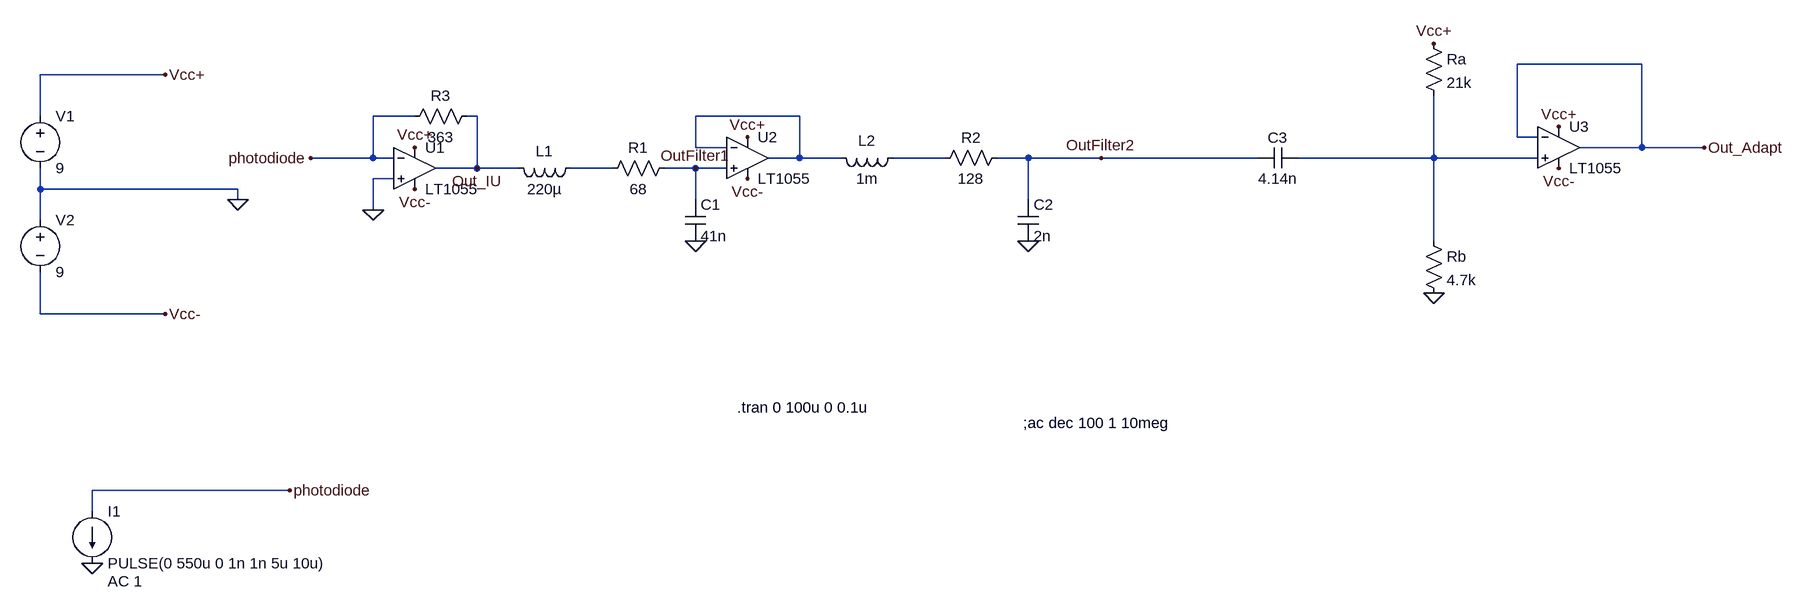
[diagram p0: schematic adaptateur_adc.asc]
adaptateur_adc.asc, the LTspice schematic file:
Version 4
SHEET 1 2272 680
WIRE 2032 -448 1840 -448
WIRE -240 -432 -432 -432
WIRE -432 -368 -432 -432
WIRE 144 -368 80 -368
WIRE 240 -368 224 -368
WIRE 736 -368 576 -368
WIRE 1840 -336 1840 -448
WIRE 1872 -336 1840 -336
WIRE 576 -320 576 -368
WIRE 624 -320 576 -320
WIRE 2032 -320 2032 -448
WIRE 2032 -320 1936 -320
WIRE 2128 -320 2032 -320
WIRE 80 -304 80 -368
WIRE 80 -304 -16 -304
WIRE 112 -304 80 -304
WIRE 736 -304 736 -368
WIRE 736 -304 688 -304
WIRE 800 -304 736 -304
WIRE 960 -304 880 -304
WIRE 1088 -304 1040 -304
WIRE 1200 -304 1088 -304
WIRE 1440 -304 1200 -304
WIRE 1712 -304 1712 -400
WIRE 1712 -304 1504 -304
WIRE 1872 -304 1712 -304
WIRE 240 -288 240 -368
WIRE 240 -288 176 -288
WIRE 304 -288 240 -288
WIRE 448 -288 384 -288
WIRE 576 -288 528 -288
WIRE 624 -288 576 -288
WIRE 112 -272 80 -272
WIRE -432 -256 -432 -288
WIRE -128 -256 -432 -256
WIRE -128 -240 -128 -256
WIRE 576 -240 576 -288
WIRE 1088 -240 1088 -304
WIRE 80 -224 80 -272
WIRE -432 -208 -432 -256
WIRE 1712 -176 1712 -304
WIRE -432 -64 -432 -128
WIRE -240 -64 -432 -64
WIRE -48 208 -352 208
WIRE -352 240 -352 208
FLAG -128 -240 0
FLAG 1088 -176 0
FLAG 576 -176 0
FLAG -240 -432 Vcc+
FLAG -240 -64 Vcc-
FLAG 144 -320 Vcc+
FLAG 656 -336 Vcc+
FLAG 144 -256 Vcc-
FLAG 656 -272 Vcc-
FLAG 576 -288 OutFilter1
FLAG 1200 -304 OutFilter2
FLAG -48 208 photodiode
FLAG -352 320 0
FLAG 80 -224 0
FLAG -16 -304 photodiode
FLAG 240 -288 Out_IU
FLAG 2128 -320 Out_Adapt
FLAG 1904 -352 Vcc+
FLAG 1904 -288 Vcc-
FLAG 1712 -96 0
FLAG 1712 -480 Vcc+
SYMBOL res 544 -304 R90
WINDOW 0 0 56 VBottom 2
WINDOW 3 32 56 VTop 2
SYMATTR InstName R1
SYMATTR Value 68
SYMBOL res 1056 -320 R90
WINDOW 0 0 56 VBottom 2
WINDOW 3 32 56 VTop 2
SYMATTR InstName R2
SYMATTR Value 128
SYMBOL ind 400 -304 R90
WINDOW 0 5 56 VBottom 2
WINDOW 3 32 56 VTop 2
SYMATTR InstName L1
SYMATTR Value 220µ
SYMATTR SpiceLine Ipk=0.6 Rser=0.75 Rpar=144700 Cpar=3.235p mfg="Bourns, Inc." pn="SDE0805A-221K"
SYMBOL ind 896 -320 R90
WINDOW 0 5 56 VBottom 2
WINDOW 3 32 56 VTop 2
SYMATTR InstName L2
SYMATTR Value 1m
SYMATTR SpiceLine Ipk=0.135 Rser=11.5 Rpar=408191 Cpar=0 mfg="Bourns, Inc." pn="SDR0503-102KL"
SYMBOL OpAmps\\LT1055 144 -352 R0
SYMATTR InstName U1
SYMBOL OpAmps\\LT1055 656 -368 R0
SYMATTR InstName U2
SYMBOL cap 560 -240 R0
SYMATTR InstName C1
SYMATTR Value 41n
SYMBOL cap 1072 -240 R0
SYMATTR InstName C2
SYMATTR Value 2n
SYMBOL voltage -432 -384 R0
WINDOW 123 0 0 Left 0
WINDOW 39 0 0 Left 0
SYMATTR InstName V1
SYMATTR Value 9
SYMBOL voltage -432 -224 R0
WINDOW 123 0 0 Left 0
WINDOW 39 0 0 Left 0
SYMATTR InstName V2
SYMATTR Value 9
SYMBOL res 240 -384 R90
WINDOW 0 0 56 VBottom 2
WINDOW 3 32 56 VTop 2
SYMATTR InstName R3
SYMATTR Value 363
SYMBOL current -352 240 R0
WINDOW 123 24 108 Left 2
WINDOW 39 0 0 Left 0
SYMATTR Value2 AC 1
SYMATTR InstName I1
SYMATTR Value PULSE(0 550u 0 1n 1n 5u 10u)
SYMBOL cap 1504 -320 R90
WINDOW 0 0 32 VBottom 2
WINDOW 3 32 32 VTop 2
SYMATTR InstName C3
SYMATTR Value 4.14n
SYMBOL res 1696 -496 R0
SYMATTR InstName Ra
SYMATTR Value 21k
SYMBOL res 1696 -192 R0
SYMATTR InstName Rb
SYMATTR Value 4.7k
SYMBOL OpAmps\\LT1055 1904 -384 R0
SYMATTR InstName U3
TEXT 640 80 Left 2 !.tran 0 100u 0 0.1u
TEXT 1080 104 Left 2 !;ac dec 100 1 10meg

The netlist it stands for:
* adaptateur_adc.asc
R1 OutFilter1 N004 68
R2 OutFilter2 N002 128
L1 N004 Out_IU 220µ Ipk=0.6 Rser=0.75 Rpar=144700 Cpar=3.235p mfg="Bourns, Inc." pn="SDE0805A-221K"
L2 N002 N001 1m Ipk=0.135 Rser=11.5 Rpar=408191 Cpar=0 mfg="Bourns, Inc." pn="SDR0503-102KL"
XU1 0 photodiode Vcc+ Vcc- Out_IU LT1055  ; pins In+ In- V+ V- OUT
XU2 OutFilter1 N001 Vcc+ Vcc- N001 LT1055  ; pins In+ In- V+ V- OUT
C1 OutFilter1 0 41n
C2 OutFilter2 0 2n
V1 Vcc+ 0 9
V2 0 Vcc- 9
R3 Out_IU photodiode 363
I1 photodiode 0 PULSE(0 550u 0 1n 1n 5u 10u) AC 1
C3 N003 OutFilter2 4.14n
Ra Vcc+ N003 21k
Rb N003 0 4.7k
XU3 N003 Out_Adapt Vcc+ Vcc- Out_Adapt LT1055  ; pins In+ In- V+ V- OUT
.tran 0 100u 0 0.1u
;ac dec 100 1 10meg
.backanno
.end